# EAGLE design PiPico_Headless (EAGLE 6.2)
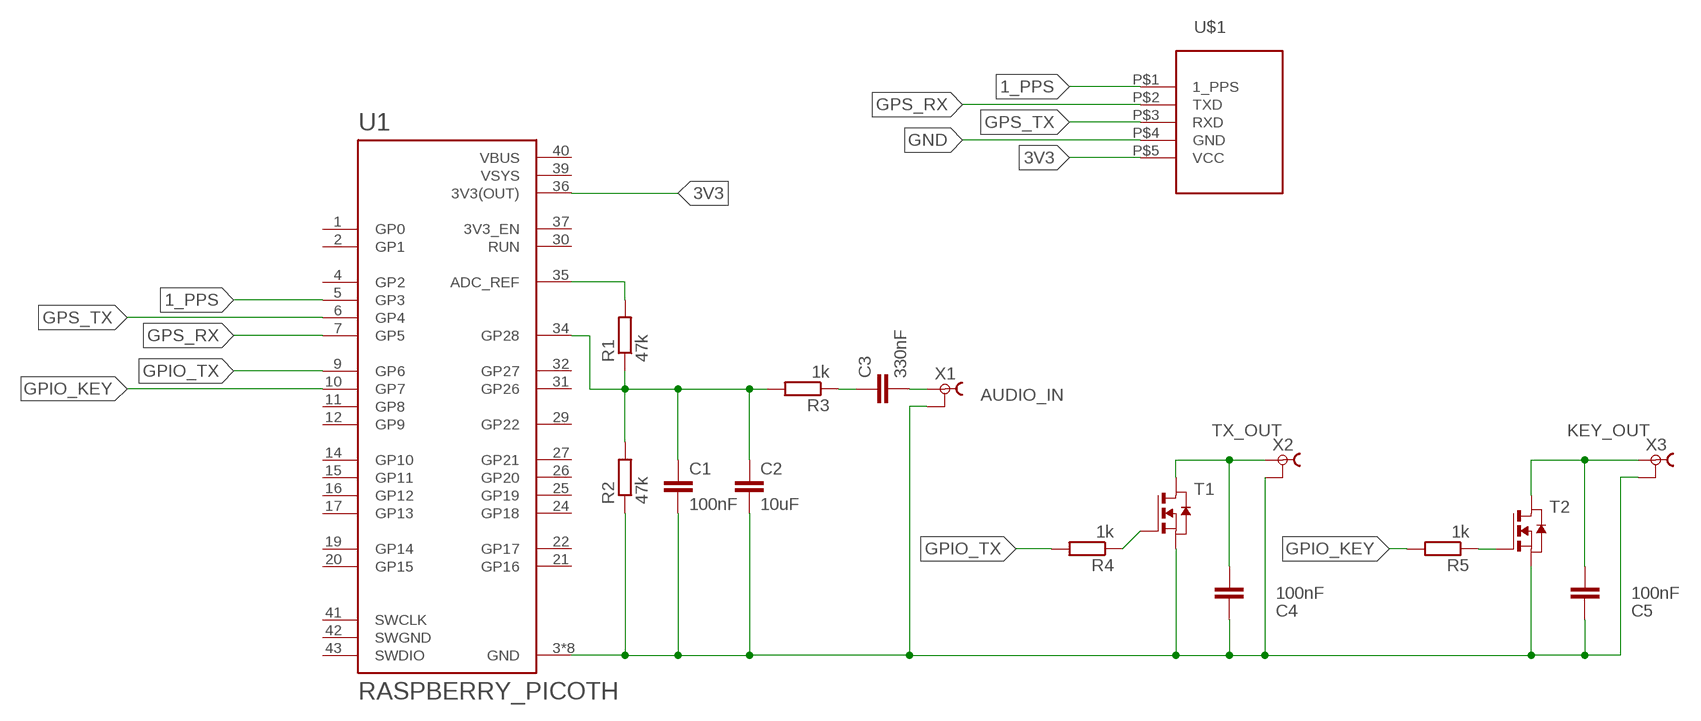
[diagram p0: schematic, sheet 1]

## Parts
C1  100nF  C-EUC0805  [C0805]
C2  10uF  C-EUC0805  [C0805]
C3  330nF  C-EUC0805  [C0805]
C4  100nF  C-EUC0805  [C0805]
C5  100nF  C-EUC0805  [C0805]
R1  47k  R-EU_R0805  [R0805]
R2  47k  R-EU_R0805  [R0805]
R3  1k  R-EU_R0805  [R0805]
R4  1k  R-EU_R0805  [R0805]
R5  1k  R-EU_R0805  [R0805]
T1  NMOSSOT23  [SOT-23]
T2  NMOSSOT23  [SOT-23]
U1  RASPBERRY_PICOTH  [PICO-PKG-TH]
U$1  GPS  [GPS]
X1  AUDIO_IN  TOBU3  [TOBU3]
X2  TX_OUT  TOBU3  [TOBU3]
X3  KEY_OUT  TOBU3  [TOBU3]

## Nets
1_PPS: U1.5(GP3) U$1.P$1(1_PPS)
3V3: U1.36(3V3(OUT)) U$1.P$5(VCC)
GND: C1.2 C2.2 C4.1 C5.1 R2.1 T1.2(S) T2.2(S) U1.3(GND) U1.8(GND) U1.13(GND) U1.18(GND) U1.23(GND) U1.28(GND) U1.33(GND) U1.38(GND) U$1.P$4(GND) X1.2 X1.2@1 X1.2@2 X2.2 X2.2@1 X2.2@2 X3.2 X3.2@1 X3.2@2
GPIO_KEY: R5.2 U1.10(GP7)
GPIO_TX: R4.2 U1.9(GP6)
GPS_RX: U1.7(GP5) U$1.P$2(TXD)
GPS_TX: U1.6(GP4) U$1.P$3(RXD)
N$1: C1.1 C2.1 R1.1 R2.2 R3.2 U1.34(GP28)
N$3: R5.1 T2.3(G)
N$4: R1.2 U1.35(ADC_REF)
N$5: C3.1 R3.1
N$6: C3.2 X1.1
N$7: R4.1 T1.3(G)
N$8: C4.2 T1.1(D) X2.1
N$9: C5.2 T2.1(D) X3.1
Unconnected: U1.1(GP0) U1.2(GP1) U1.4(GP2) U1.11(GP8) U1.12(GP9) U1.14(GP10) U1.15(GP11) U1.16(GP12) U1.17(GP13) U1.19(GP14) U1.20(GP15) U1.21(GP16) U1.22(GP17) U1.24(GP18) U1.25(GP19) U1.26(GP20) U1.27(GP21) U1.29(GP22) U1.30(RUN) U1.31(GP26) U1.32(GP27) U1.37(3V3_EN) U1.41(SWCLK) U1.43(SWDIO)

## Power pins joined to a net without a drawn wire
SWGND: U1.42(SWGND)
VBUS: U1.40(VBUS)
VSYS: U1.39(VSYS)

## Library data of the parts
C1-C5 = resistor:C-EU: CAPACITOR, European symbol
R1-R5 = resistor:R-EU_: RESISTOR, European symbol
T1 T2 = zetex:NMOSSOT23: MOS FET; OC_FARNELL: unknown; OC_NEWARK: unknown
U1 = RpiPico:RASPBERRY_PICO: Raspberry Pi Pico
U$1 = gps:GPS
X1-X3 = con-hirschmann:TOBU3: Female Cinch CONNECTOR ( RCA Jack ); MF: FARNELL; MPN: TOBU 3; OC_FARNELL: 592791; OC_NEWARK: 06WX5914

## Board
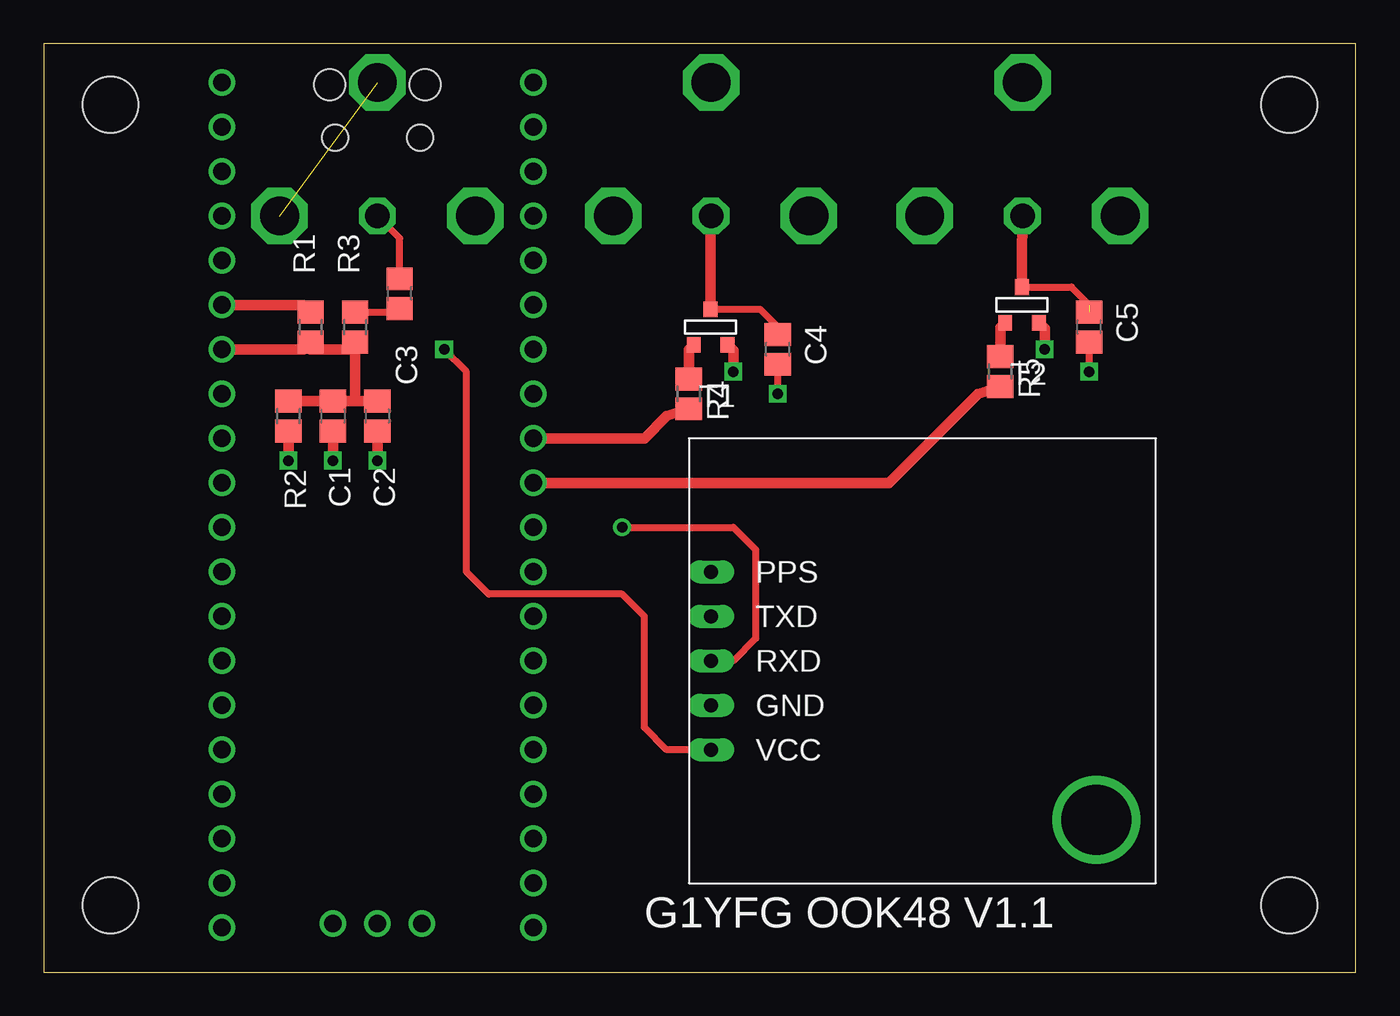
[diagram p1: board, top side]
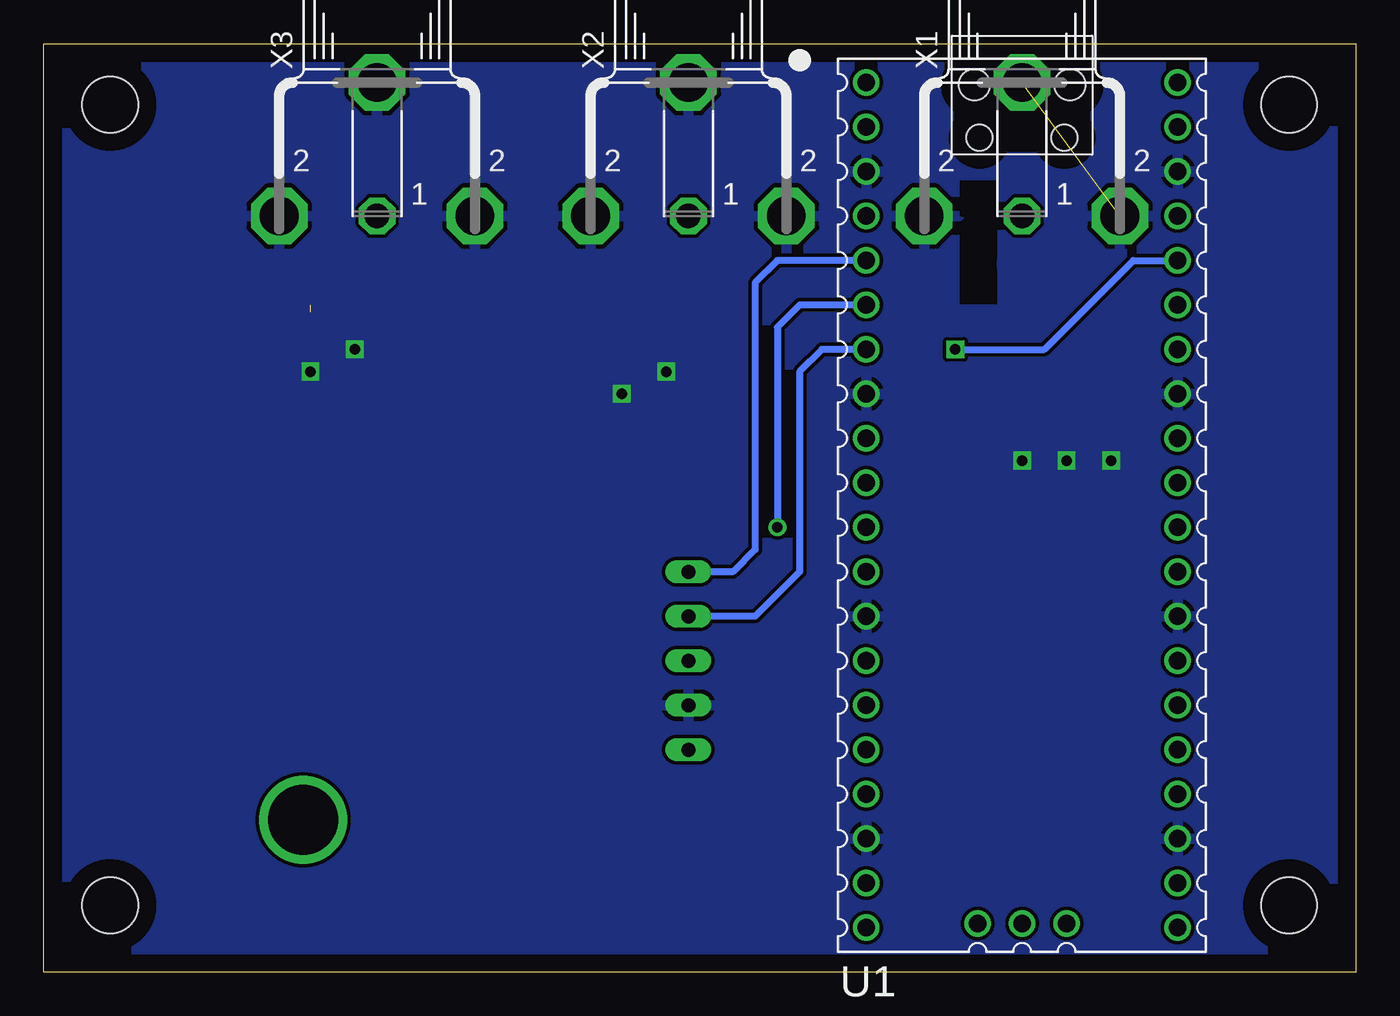
[diagram p2: board, bottom side, seen from below]

Size 74.91 x 53.01 mm. Coordinates in mm from the lower left corner, seen from the top.
Outline: 0,0 74.91,0 74.91,53.01 0,53.01 0,0
Copper layers (1*16): Top 0.035mm / dielectric 1.5mm / Bottom 0.035mm
Design rules: minimum track width 10mil, minimum drill 24mil, track to track 8mil, track to pad 8mil, pad to pad 8mil, via to via 8mil, smd to smd 8mil, copper to edge 40mil, drill to drill 8mil, minimum pad ring 10mil, minimum via ring 8mil, stop-mask expansion 4mil, vias tented up to drill 0mil, thermal gap 10mil
Holes 3.2 mm at 3.81,49.53 3.81,3.81 71.12,3.81 71.12,49.53

### Footprints (pad centres in the part's own frame; a part is rotated, then mirrored left to right if it is on the bottom)
C0805 = smd 1.3 x 1.5: 1 -0.85,0; 2 0.85,0
R0805 = smd 1.3 x 1.5: 1 -0.85,0; 2 0.85,0
SOT-23 = smd 0.787 x 0.889: 1 0.025,-1.016; 2 -0.94,1.016; 3 0.991,1.016
PICO-PKG-TH = drill 1: 1 -8.89,24.13; 2 -8.89,21.59; 3 -8.89,19.05; 4 -8.89,16.51; 5 -8.89,13.97; 6 -8.89,11.43; 7 -8.89,8.89; 8 -8.89,6.35; 9 -8.89,3.81; 10 -8.89,1.27; 11 -8.89,-1.27; 12 -8.89,-3.81; 13 -8.89,-6.35; 14 -8.89,-8.89; 15 -8.89,-11.43; 16 -8.89,-13.97; 17 -8.89,-16.51; 18 -8.89,-19.05; 19 -8.89,-21.59; 20 -8.89,-24.13; 21 8.89,-24.13; 22 8.89,-21.59; 23 8.89,-19.05; 24 8.89,-16.51; 25 8.89,-13.97; 26 8.89,-11.43; 27 8.89,-8.89; 28 8.89,-6.35; 29 8.89,-3.81; 30 8.89,-1.27; 31 8.89,1.27; 32 8.89,3.81; 33 8.89,6.35; 34 8.89,8.89; 35 8.89,11.43; 36 8.89,13.97; 37 8.89,16.51; 38 8.89,19.05; 39 8.89,21.59; 40 8.89,24.13; 41 -2.54,-23.9; 42 0,-23.9; 43 2.54,-23.9 | hole 1.8: -2.725,24; 2.725,24 | hole 1.5: -2.425,20.97; 2.425,20.97
GPS = drill 0.8 long: P$1 0,5.08; P$2 0,2.54; P$3 0,0; P$4 0,-2.54; P$5 0,-5.08 | drill 4: P$6 22,-9.08
TOBU3 = drill 1.397 octagon: 1 0,-2.54 | drill 2.21 octagon: 2 5.588,-2.54; 2@1 -5.588,-2.54; 2@2 0,5.08

### Placement (x,y rotation side)
C1  16.51,31.75 270 top
C2  19.05,31.75 270 top
C3  20.32,38.73 90 top
C4  41.91,35.56 90 top
C5  59.69,36.83 90 top
R1  15.24,36.83 90 top
R2  13.97,31.75 90 top
R3  17.78,36.83 270 top
R4  36.83,33.02 270 top
R5  54.61,34.29 270 top
T1  38.1,36.83 180 top
T2  55.88,38.1 180 top
U1  19.05,26.67 0 bottom
U$1  38.1,17.78 0 top
X1  19.05,45.72 0 bottom
X2  38.1,45.72 0 bottom
X3  55.88,45.72 0 bottom

### Tracks (layer width: path | path; a pad name or v marks a point on that pad's centre or on a via)
1_PPS
  Bottom 0.406: U1.5 33.02,40.64 34.29,39.37 34.29,24.13 35.56,22.86 U$1.P$1
3V3  (via drill 0.6)
  Top 0.406: U$1.P$5 35.56,12.7 34.29,13.97 34.29,20.32 33.02,21.59 25.4,21.59 24.13,22.86 24.13,34.29 v22.86,35.56
  Bottom 0.406: v22.86,35.56 17.78,35.56 12.7,40.64 U1.36
GND  (via drill 0.6)  (1 unrouted)
  Top 0.406: v41.91,33.02 C4.1 | v59.69,34.29 C5.1
  Top 0.61: v13.97,29.21 R2.1 | v16.51,29.21 C1.2 | v19.05,29.21 C2.2 | v57.15,35.56 57.15,36.75 T2.2 | v39.37,34.29 39.37,35.48 T1.2
  pour Bottom: 1.27,52.07 73.66,52.07 73.66,1.27 1.27,1.27
GPIO_KEY
  Top 0.61: U1.10 48.26,27.94 53.34,33.02 R5.2
GPIO_TX
  Top 0.61: U1.9 34.29,30.48 35.56,31.75 R4.2
GPS_RX
  Bottom 0.406: U1.7 30.48,35.56 31.75,34.29 31.75,22.86 34.29,20.32 U$1.P$2
GPS_TX  (via drill 0.6)
  Top 0.406: v33.02,25.4 39.37,25.4 40.64,24.13 40.64,19.05 39.37,17.78 U$1.P$3
  Bottom 0.406: U1.6 31.75,38.1 33.02,36.83 v33.02,25.4
N$1
  Top 0.61: R2.2 C1.1 17.78,32.6 | 17.78,32.6 C2.1 | 17.78,32.6 R3.2 17.36,35.56 15.24,35.56 R1.1 14.82,35.56 U1.34
N$3
  Top 0.61: R5.1 54.61,36.8 T2.3
N$4
  Top 0.61: U1.35 14.82,38.1 R1.2
N$5
  Top 0.406: R3.1 20.12,37.68 C3.1
N$6
  Top 0.406: C3.2 20.32,41.91 X1.1
N$7
  Top 0.61: R4.1 36.83,35.53 T1.3
N$8
  Top 0.406: T1.1 40.89,37.85 41.91,36.83 C4.2
  Top 0.61: T1.1 38.07,41.88 X2.1
N$9  (1 unrouted)
  Top 0.406: T2.1 58.67,39.12 59.69,38.1
  Top 0.61: T2.1 55.85,40.62 X3.1

### Text on the board
tPlace: G1YFG OOK48 V1.1